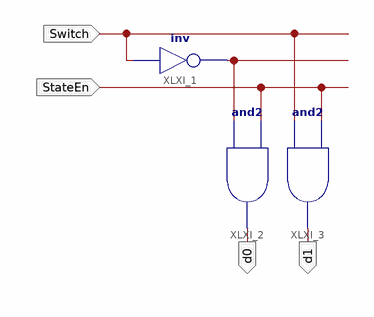
[diagram p0: schematic sheet 1]
// Xilinx ISE schematic OneBitDecoder.sch (spartan3e) as structural Verilog: 3 symbols, 4 ports
module OneBitDecoder (
  input  Switch,
  input  StateEn,
  output d0,
  output d1
);

  wire XLXN_4;

  not XLXI_1 (XLXN_4, Switch);
  and XLXI_2 (d0, XLXN_4, StateEn);
  and XLXI_3 (d1, Switch, StateEn);
endmodule
